# Altium schematic sheet MAX3738ETG+ MB.SchDoc
size A3; Address1: Address1; Address2: Address2; Address3: Address3; Address4: Address4; DocumentNumber: АБВГ.123456.001 Э3; SheetNumber: 1; Scale: 1:1; DocumentType: Схема электрическая принципиальная; FirstReferrence: АБВГ.123456.001
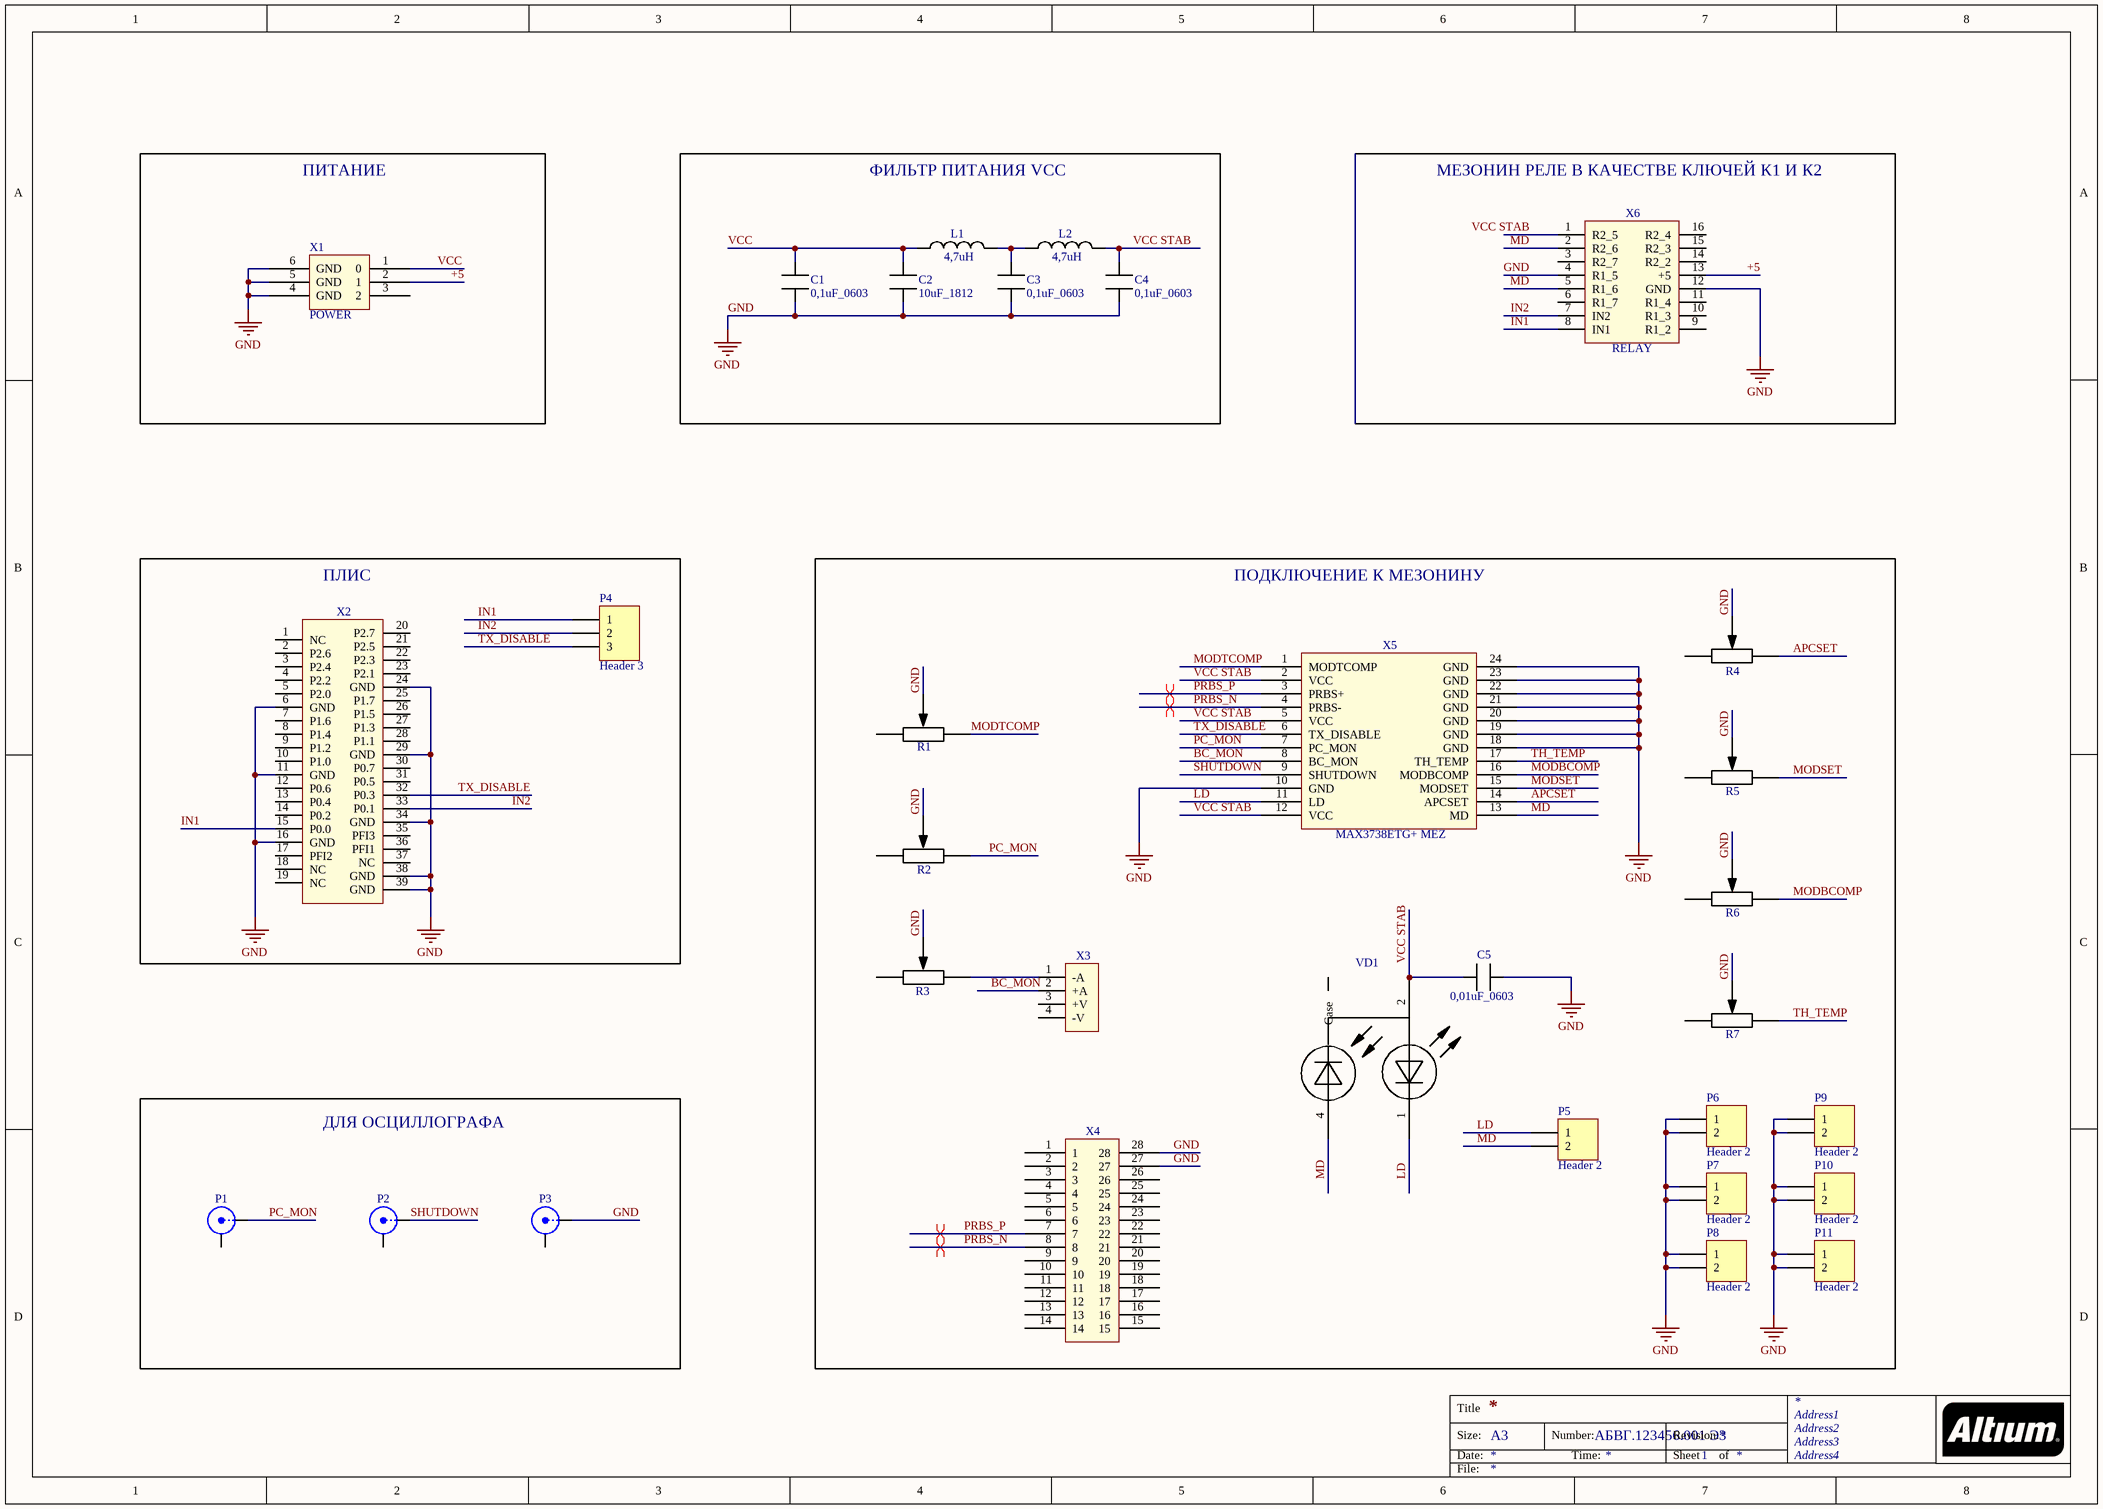
[diagram p0: MAX3738ETG+ MB.SchDoc]

## Parts
C1  0,1uF_0603  [CAP_0603]
C2  10uF_1812  [CAP_1812]
C3  0,1uF_0603  [CAP_0603]
C4  0,1uF_0603  [CAP_0603]
C5  0,01uF_0603  [CAP_0603]
L1  4,7uH  [IND_0805]
L2  4,7uH  [IND_0805]
P1  BNC  [BNC_RA CON]  (value not drawn)
P2  BNC  [BNC_RA CON]  (value not drawn)
P3  BNC  [BNC_RA CON]  (value not drawn)
P4  Header 3  [HDR1X3]
P5  Header 2  [HDR1X2]
P6  Header 2  [HDR1X2]
P7  Header 2  [HDR1X2]
P8  Header 2  [HDR1X2]
P9  Header 2  [HDR1X2]
P10  Header 2  [HDR1X2]
P11  Header 2  [HDR1X2]
R1  RES 3266W  [RES 3266W]  (value not drawn)
R2  RES 3266W  [RES 3266W]  (value not drawn)
R3  RES 3266W  [RES 3266W]  (value not drawn)
R4  RES 3266W  [RES 3266W]  (value not drawn)
R5  RES 3266W  [RES 3266W]  (value not drawn)
R6  RES 3266W  [RES 3266W]  (value not drawn)
R7  RES 3266W  [RES 3266W]  (value not drawn)
VD1  LD with MD  [AMP_VOLTMETER]  (value not drawn)
X1  POWER  [POWER]
X2  CHEAP_CON_37_FEMALE  [CHEAP_CONN_FEMALE]  (value not drawn)
X3  AMPVOLT  [AMP_VOLTMETER]  (value not drawn)
X4  DHR-26F  [DHR-26F]  (value not drawn)
X5  MAX3738ETG+ MEZ  [MAX3738ETG+ MEZ]
X6  RELAY  [RELAY_MODULE]

## Blocks framed on the sheet
ПИТАНИЕ: X1
ФИЛЬТР ПИТАНИЯ VCC: C1-C4 L1 L2
ПЛИС: P4 X2
ПОДКЛЮЧЕНИЕ К МЕЗОНИНУ: C5 P5-P11 R1-R7 VD1 X3-X5
ДЛЯ ОСЦИЛЛОГРАФА: P1-P3

## Nets
GND: C1.1 C2.1 C3.1 C4.1 C5.1 P3.1(X) P6.1 P6.2 P7.1 P7.2 P8.1 P8.2 P9.1 P9.2 P10.1 P10.2 P11.1 P11.2 R1.2 R2.2 R3.2 R4.2 R5.2 R6.2 R7.2 X1.4(GND) X1.5(GND) X1.6(GND) X2.6(GND) X2.11(GND) X2.16(GND) X2.24(GND) X2.29(GND) X2.34(GND) X2.38(GND) X2.39(GND) X4.27 X4.28 X5.10(GND) X5.18(GND) X5.19(GND) X5.20(GND) X5.21(GND) X5.22(GND) X5.23(GND) X5.24(GND) X6.4(R1_5) X6.12(GND)
+5: X1.2(1) X6.13(+5)
APCSET: R4.3 X5.14(APCSET)
BC_MON: X3.2(+A) X5.8(BC_MON)
IN1: P4.1 X2.15(P0.0) X6.8(IN1)
IN2: P4.2 X2.33(P0.1) X6.7(IN2)
LD: P5.1 VD1.1 X5.11(LD)
MD: P5.2 VD1.4 X5.13(MD) X6.2(R2_6) X6.5(R1_6)
MODBCOMP: R6.3 X5.16(MODBCOMP)
MODSET: R5.3 X5.15(MODSET)
MODTCOMP: R1.3 X5.1(MODTCOMP)
PC_MON: P1.1(X) R2.3 X5.7(PC_MON)
PRBS_N: X4.8 X5.4(PRBS-)
PRBS_P: X4.7 X5.3(PRBS+)
SHUTDOWN: P2.1(X) X5.9(SHUTDOWN)
TH_TEMP: R7.3 X5.17(TH_TEMP)
TX_DISABLE: P4.3 X2.32(P0.3) X5.6(TX_DISABLE)
VCC: C1.2 C2.2 L1.1 X1.1(0)
VCC STAB: C4.2 C5.2 L2.2 VD1.2 X5.2(VCC) X5.5(VCC) X5.12(VCC) X6.1(R2_5)
NetC3_2: C3.2 L1.2 L2.1
NetR3_3: R3.3 X3.1(-A)

Not connected (* = marked no-connect by the designer): P1 2(Y); P2 2(Y); P3 2(Y); R1 1; R2 1; R3 1; R4 1; R5 1; R6 1; R7 1; VD1 3(Case); X1 3(2); X2 1(NC) 2(P2.6) 3(P2.4) 4(P2.2) 5(P2.0) 7(P1.6) 8(P1.4) 9(P1.2) 10(P1.0) 12(P0.6) 13(P0.4) 14(P0.2) 17(PFI2) 18(NC) 19(NC) 20(P2.7) 21(P2.5) 22(P2.3) 23(P2.1) 25(P1.7) 26(P1.5) 27(P1.3) 28(P1.1) 30(P0.7) 31(P0.5) 35(PFI3) 36(PFI1) 37(NC); X3 3(+V) 4(-V); X4 1 2 3 4 5 6 9 10 11 12 13 14 15 16 17 18 19 20 21 22 23 24 25 26; X6 3(R2_7) 6(R1_7) 9(R1_2) 10(R1_3) 11(R1_4) 14(R2_2) 15(R2_3) 16(R2_4)

## Layout directives
differential pair: PRBS_N, PRBS_P

## Notes on the sheet
- МЕЗОНИН РЕЛЕ В КАЧЕСТВЕ КЛЮЧЕЙ К1 И К2
- Title
- Size:
- Date:
- A3
- Number:
- Time:
- Revision:
- Sheet
- of
- File:

## Library data of the parts
C1-C5 = CAP
L1 L2 = IND
P1-P3 = BNC: BNC Elbow Connector; LatestRevisionDate: 17-Jul-2002; LatestRevisionNote: Re-released for DXP Platform.; Publisher: Altium Limited
P4 = Header 3: Header, 3-Pin; LatestRevisionDate: 17-Jul-2002; LatestRevisionNote: Re-released for DXP Platform.; Publisher: Altium Limited
P5-P11 = Header 2: Header, 2-Pin; LatestRevisionDate: 17-Jul-2002; LatestRevisionNote: Re-released for DXP Platform.; Publisher: Altium Limited
X3 = AMP_VOLTMETER
X6 = MEZON_RELAY